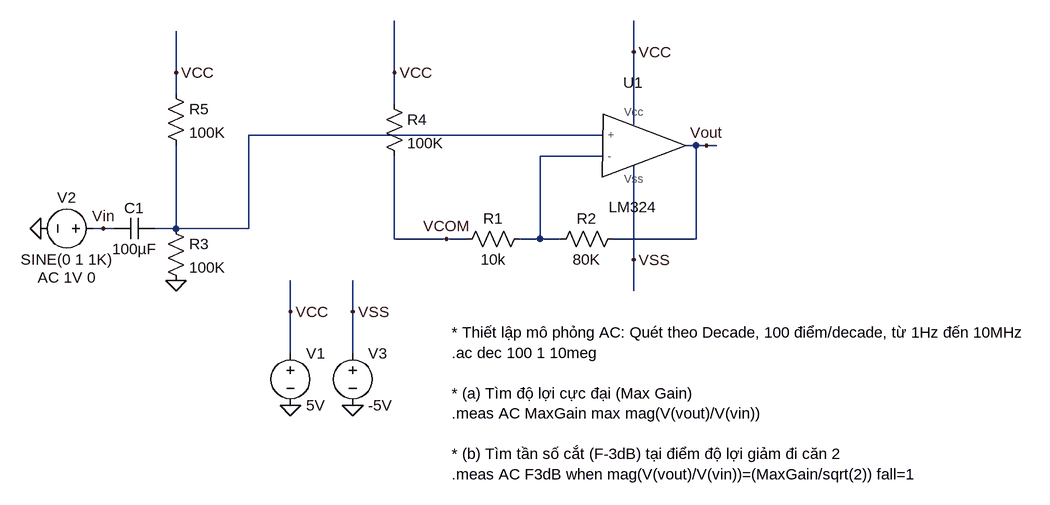
[diagram p0: schematic BAI 2 THUC HANH 2.asc]
BAI 2 THUC HANH 2.asc, the LTspice schematic file:
Version 4.1
SHEET 1 912 680
WIRE 240 0 240 -48
WIRE -464 32 -464 -32
WIRE -128 32 -128 -48
WIRE -464 64 -464 32
WIRE -128 80 -128 32
WIRE 240 112 240 0
WIRE 192 128 -352 128
WIRE 336 144 320 144
WIRE 352 144 336 144
WIRE 368 144 352 144
WIRE 192 160 96 160
WIRE -576 272 -592 272
WIRE -560 272 -576 272
WIRE -464 272 -464 144
WIRE -464 272 -496 272
WIRE -352 272 -352 128
WIRE -352 272 -464 272
WIRE -128 288 -128 160
WIRE -48 288 -128 288
WIRE -16 288 -48 288
WIRE 96 288 96 160
WIRE 96 288 64 288
WIRE 128 288 96 288
WIRE 336 288 336 144
WIRE 336 288 208 288
WIRE 240 320 240 176
WIRE 240 368 240 320
WIRE -288 400 -288 352
WIRE -192 400 -192 352
WIRE -288 464 -288 400
WIRE -192 464 -192 400
FLAG 240 0 VCC
FLAG 240 320 VSS
FLAG 352 144 Vout
FLAG -48 288 VCOM
FLAG -464 352 0
FLAG -128 32 VCC
FLAG -672 272 0
FLAG -288 400 VCC
FLAG -288 544 0
FLAG -464 32 VCC
FLAG -576 272 Vin
FLAG -192 400 VSS
FLAG -192 544 0
SYMBOL LM324 240 144 R0
SYMATTR InstName U1
SYMBOL res 224 272 R90
WINDOW 0 0 56 VBottom 2
WINDOW 3 32 56 VTop 2
SYMATTR InstName R2
SYMATTR Value 80K
SYMBOL res 80 272 R90
WINDOW 0 0 56 VBottom 2
WINDOW 3 32 56 VTop 2
SYMATTR InstName R1
SYMATTR Value 10k
SYMBOL res -144 64 R0
SYMATTR InstName R4
SYMATTR Value 100K
SYMBOL res -480 256 R0
SYMATTR InstName R3
SYMATTR Value 100K
SYMBOL voltage -576 272 R90
WINDOW 0 -32 56 VBottom 2
WINDOW 3 32 56 VTop 2
WINDOW 123 60 56 VTop 2
WINDOW 39 0 0 Left 0
SYMATTR InstName V2
SYMATTR Value SINE(0 1 1K)
SYMATTR Value2 AC 1V 0
SYMBOL voltage -288 448 R0
SYMATTR InstName V1
SYMATTR Value 5V
SYMBOL res -480 48 R0
SYMATTR InstName R5
SYMATTR Value 100K
SYMBOL cap -496 256 R90
WINDOW 0 0 32 VBottom 2
WINDOW 3 32 32 VTop 2
SYMATTR InstName C1
SYMATTR Value 100µF
SYMBOL voltage -192 448 R0
SYMATTR InstName V3
SYMATTR Value -5V
TEXT -40 432 Left 2 !* Thiết lập mô phỏng AC: Quét theo Decade, 100 điểm/decade, từ 1Hz đến 10MHz\n.ac dec 100 1 10meg\n \n* (a) Tìm độ lợi cực đại (Max Gain)\n.meas AC MaxGain max mag(V(vout)/V(vin))\n \n* (b) Tìm tần số cắt (F-3dB) tại điểm độ lợi giảm đi căn 2\n.meas AC F3dB when mag(V(vout)/V(vin))=(MaxGain/sqrt(2)) fall=1

The netlist it stands for:
* BAI 2 THUC HANH 2.asc
X§U1 N001 N002 VCC VSS Vout LM324  ; pins + - Vcc Vss ?
R2 Vout N002 80K
R1 N002 VCOM 10k
R4 VCC VCOM 100K
R3 N001 0 100K
V2 Vin 0 SINE(0 1 1K) AC 1V 0
V1 VCC 0 5V
R5 VCC N001 100K
C1 N001 Vin 100µF
V3 VSS 0 -5V
* Thiết lập mô phỏng AC: Quét theo Decade, 100 điểm/decade, từ 1Hz đến 10MHz
.ac dec 100 1 10meg
* (a) Tìm độ lợi cực đại (Max Gain)
.meas AC MaxGain max mag(V(vout)/V(vin))
* (b) Tìm tần số cắt (F-3dB) tại điểm độ lợi giảm đi căn 2
.meas AC F3dB when mag(V(vout)/V(vin))=(MaxGain/sqrt(2)) fall=1
.lib E:\ThiThucHanhCoHa\CoHa\LM324.cir
.backanno
.end